# Altium schematic sheet SATELLITE.SchDoc
size A; SheetNumber: 1; SheetTotal: 1
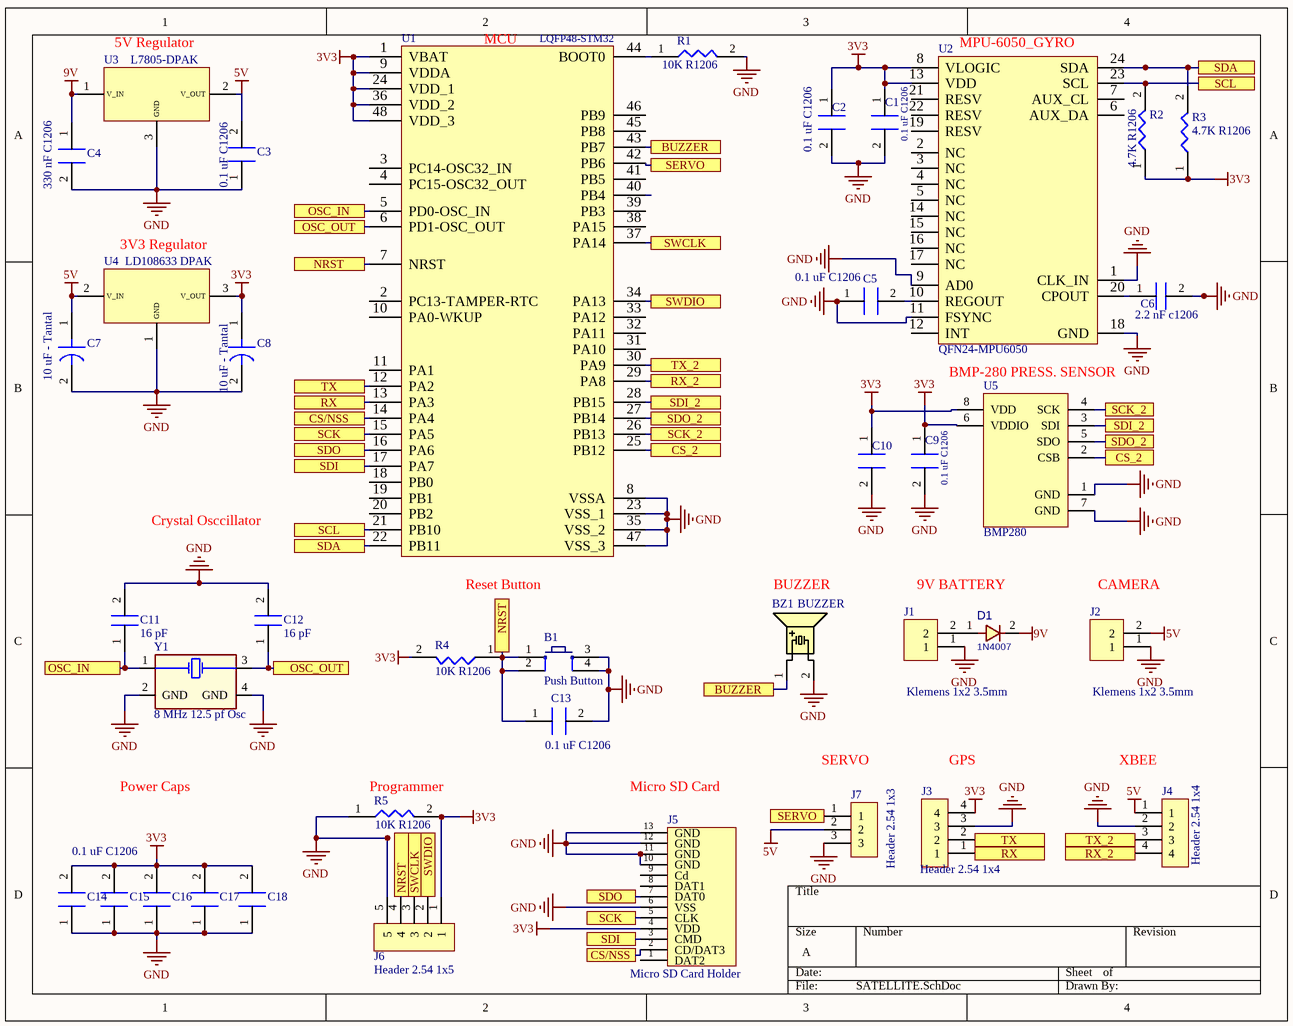
[diagram p0: SATELLITE.SchDoc]

## Parts
B1  Push Button  [PUSB BUTTON-SMD]
BZ1  BUZZER  [BZ_C9]
C1  0.1 uF C1206  [C1206]  (value not drawn)
C2  0.1 uF C1206  [C1206]  (value not drawn)
C3  0.1 uF C1206  [C1206]
C4  330 nF C1206  [C1206]
C5  0.1 uF C1206  [C1206]
C6  2.2 nF c1206  [C1206]
C7  10 uF - Tantal  [C1206- TANTAL]
C8  10 uF - Tantal  [C1206- TANTAL]
C9  0.1 uF C1206  [C1206]  (value not drawn)
C10  0.1 uF C1206  [C1206]  (value not drawn)
C11  16 pF  [C1206]
C12  16 pF  [C1206]
C13  0.1 uF C1206  [C1206]
C14  0.1 uF C1206  [C1206]
C15  0.1 uF C1206  [C1206]  (value not drawn)
C16  0.1 uF C1206  [C1206]  (value not drawn)
C17  0.1 uF C1206  [C1206]  (value not drawn)
C18  0.1 uF C1206  [C1206]  (value not drawn)
D1  1N4007  [D_SMA]
J1  Klemens 1x2 3.5mm  [Klemens 1x2 - 3.5mm]
J2  Klemens 1x2 3.5mm  [Klemens 1x2 - 3.5mm]
J3  Header 2.54 1x4  [Header 2.54 1x4]
J4  Header 2.54 1x4  [Header 2.54 1x4]
J5  Micro SD Card Holder  [Micro SD Card Holder]
J6  Header 2.54 1x5  [Header 2.54 1x5]
J7  Header 2.54 1x3  [Header 2.54 1x3]
R1  10K R1206  [R1206 Resıstor]
R2  4.7K R1206  [R1206 Resıstor]
R3  4.7K R1206  [R1206 Resıstor]
R4  10K R1206  [R1206 Resıstor]
R5  10K R1206  [R1206 Resıstor]
U1  LQFP48-STM32  [LQFP48-STM32]
U2  QFN24-MPU6050  [QFN50P400X400X90_HS-25N_MPU6050_GYRO]
U3  L7805-DPAK  [DPAK-L7805-LD108633]
U4  LD108633 DPAK  [DPAK-L7805-LD108633]
U5  BMP280  [BMP280]
Y1  8 MHz 12.5 pf Osc  [8 MHZ Osc.]

## Ports
BUZZER, CS/NSS, CS_2, NRST, OSC_IN, OSC_OUT, RX, RX_2, SCK, SCK_2, SCL, SDA, SDI, SDI_2, SDO, SDO_2, SERVO, SWCLK, SWDIO, TX, TX_2

## Nets
3V3: C1.1 C2.1 C8.1 C9.1 C10.1 C14.2 C15.2 C16.2 C17.2 C18.2 J3.4 J5.4(VDD) J6.1 R2.1 R3.1 R4.2 R5.2 U1.1(VBAT) U1.9(VDDA) U1.24(VDD_1) U1.36(VDD_2) U1.48(VDD_3) U2.8(VLOGIC) U2.13(VDD) U4.3(V_OUT) U5.6(VDDIO) U5.8(VDD)
5V: C3.2 C7.1 J2.2 J4.1 J7.2 U3.2(V_OUT) U4.2(V_IN)
9V: C4.1 D1.2 U3.1(V_IN)
GND: B1.3 B1.4 BZ1.2(B) C1.2 C2.2 C3.1 C4.2 C5.1 C6.2 C7.2 C8.2 C9.2 C10.2 C11.2 C12.2 C13.2 C14.1 C15.1 C16.1 C17.1 C18.1 J1.1 J2.1 J3.3 J4.2 J5.6(VSS) J5.10(GND) J5.11(GND) J5.12(GND) J5.13(GND) J6.5 J7.3 R1.2 R5.1 U1.8(VSSA) U1.23(VSS_1) U1.35(VSS_2) U1.47(VSS_3) U2.1(CLK_IN) U2.9(AD0) U2.11(FSYNC) U2.18(GND) U3.3(GND) U4.1(GND) U5.1(GND) U5.7(GND) Y1.2(GND) Y1.4(GND)
BUZZER: BZ1.1(A) U1.43(PB7) ; port BUZZER
CS/NSS: J5.2(CD/DAT3) U1.14(PA4) ; port CS/NSS
CS_2: U1.25(PB12) U5.2(CSB) ; port CS_2
NRST: B1.1 B1.2 C13.1 J6.4 R4.1 U1.7(NRST) ; port NRST
OSC_IN: C11.1 U1.5(PD0-OSC_IN) Y1.1 ; port OSC_IN
OSC_OUT: C12.1 U1.6(PD1-OSC_OUT) Y1.3 ; port OSC_OUT
RX: J3.1 U1.13(PA3) ; port RX
RX_2: J4.4 U1.29(PA8) ; port RX_2
SCK: J5.5(CLK) U1.15(PA5) ; port SCK
SCK_2: U1.26(PB13) U5.4(SCK) ; port SCK_2
SCL: R2.2 U1.21(PB10) U2.23(SCL) ; port SCL
SDA: R3.2 U1.22(PB11) U2.24(SDA) ; port SDA
SDI: J5.3(CMD) U1.17(PA7) ; port SDI
SDI_2: U1.28(PB15) U5.3(SDI) ; port SDI_2
SDO: J5.7(DAT0) U1.16(PA6) ; port SDO
SDO_2: U1.27(PB14) U5.5(SDO) ; port SDO_2
SERVO: J7.1 U1.42(PB6) ; port SERVO
SWCLK: J6.3 U1.37(PA14) ; port SWCLK
SWDIO: J6.2 U1.34(PA13) ; port SWDIO
TX: J3.2 U1.12(PA2) ; port TX
TX_2: J4.3 U1.30(PA9) ; port TX_2
NetC5_2: C5.2 U2.10(REGOUT)
NetC6_1: C6.1 U2.20(CPOUT)
NetD1_1: D1.1 J1.2
NetR1_1: R1.1 U1.44(BOOT0)

Not connected (* = marked no-connect by the designer): J5 1(DAT2) 8(DAT1) 9(Cd); U1 2(PC13-TAMPER-RTC) 3(PC14-OSC32_IN) 4(PC15-OSC32_OUT) 10(PA0-WKUP) 11(PA1) 18(PB0) 19(PB1) 20(PB2) 31(PA10) 32(PA11) 33(PA12) 38(PA15) 39(PB3) 40(PB4) 41(PB5) 45(PB8) 46(PB9); U2 2(NC) 3(NC) 4(NC) 5(NC) 6(AUX_DA) 7(AUX_CL) 12(INT) 14(NC) 15(NC) 16(NC) 17(NC) 19(RESV) 21(RESV) 22(RESV)

## Notes on the sheet
- (near U3) 5V Regulator
- (near U1) MCU
- (near U2) MPU-6050_GYRO
- (near C2) 0.1 uF C1206
- 0.1 uF C1206
- (near U4) 3V3 Regulator
- BMP-280 PRESS. SENSOR
- (near C9) 0.1 uF C1206
- Crystal Osccillator
- (near U1) Reset Button
- BUZZER
- 9V BATTERY
- (near J2) CAMERA
- (near J7) SERVO
- (near J3) GPS
- (near J4) XBEE
- Power Caps
- (near R5) Programmer
- (near J5) Micro SD Card

## Library data of the parts
B1 = Push Button: Smd Push Button; Satın Alma Linki: https://urun.n11.com/diger/mini-pushbutton-switch-smd-P227461537?gclid=Cj0KCQjwkoDmBRCcARIsAG3xzl8Y_-jeD7HocNM6lvuZ_rVp83568XPGtNzlPwXWLph8oCRqo0yh87UaApZYEALw_wcB&gclsrc=aw.ds
BZ1 = BUZZER_C9: Buzzer, 9mm, Magnetic Transducer; MANF: Mallory; MANF_P#: PB-09N23P-03Q; PARAM2: 3V, 30mA; PARAM: 2.7KHz; PRICE: $3; VALUE: BUZZER
D1 = DIODE_SMD_1N4007: DIODE, GENERAL PURPOSE, 1000V/1A; MANF: Kingtronics; DESC: DESCRIPTION; PARAM: 1000V VRRM; PARAM2: 1A; MANF_P#: M7; ASSEMBLY: ASSEMBLY; PRICE: PRICE; VALUE: 1N4007
U1 = LQFP48-STM32: STM32f101 48 Pins MICROCONTROLLER
U2 = QFN24-MPU6050: MPU6050_GYRO
U3 = L7805-DPAK: L7805 5V REGULATOR SMD Pack_3 Pins
U4 = LD108633 DPAK: SMD,LD108633 DPAK 3.3V REGULATOR
U5 = BMP280: Pressure Sensor